# Altium schematic sheet HeadSensors.SchDoc
size A4 portrait; SheetNumber: 1; SheetTotal: 1
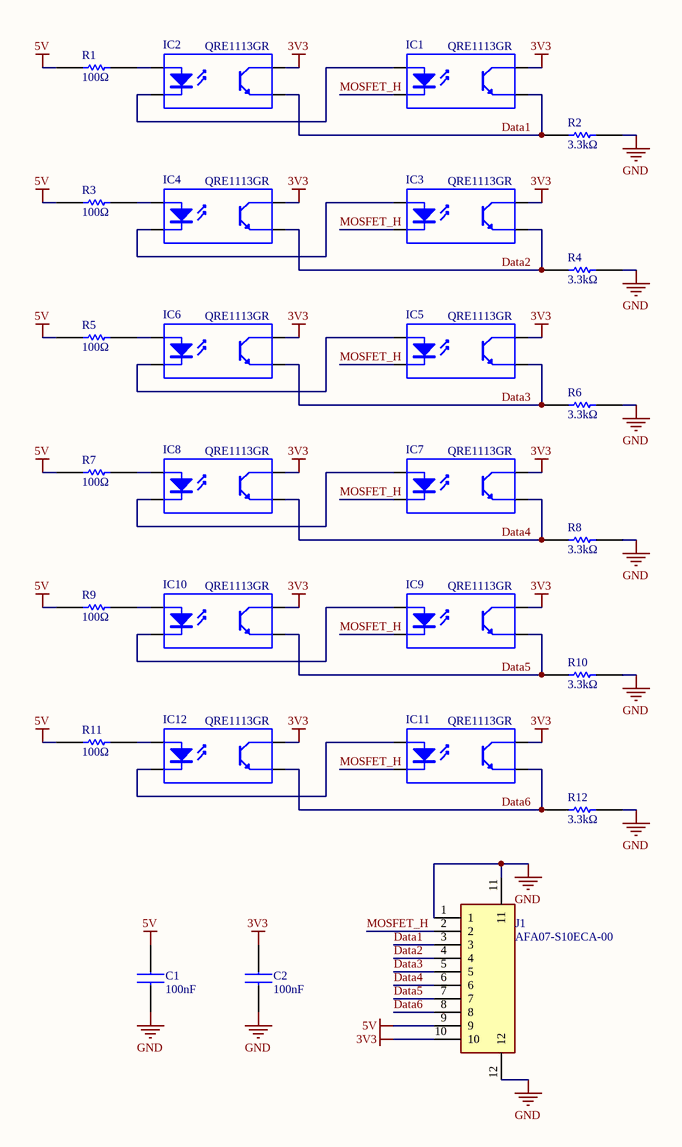
[diagram p0: HeadSensors.SchDoc]

## Parts
C1  value 100nF  [CAP0805]  (hidden comment: CC0805KRX7R9BB104)
C2  value 100nF  [CAP0805]  (hidden comment: CC0805KRX7R9BB104)
IC1  QRE1113GR  [SOIC4- Head]
IC2  QRE1113GR  [SOIC4- Head]
IC3  QRE1113GR  [SOIC4- Head]
IC4  QRE1113GR  [SOIC4- Head]
IC5  QRE1113GR  [SOIC4- Head]
IC6  QRE1113GR  [SOIC4- Head]
IC7  QRE1113GR  [SOIC4- Head]
IC8  QRE1113GR  [SOIC4- Head]
IC9  QRE1113GR  [SOIC4- Head]
IC10  QRE1113GR  [SOIC4- Head]
IC11  QRE1113GR  [SOIC4- Head]
IC12  QRE1113GR  [SOIC4- Head]
J1  AFA07-S10ECA-00  [FPC-SMD-P1.00-10P_LCS-SJ-H2.5]
R1  value 100Ω  [RES0805]  (hidden comment: 0805W8F1000T5E)
R2  value 3.3kΩ  [RES0805]  (hidden comment: 0805W8F3301T5E)
R3  value 100Ω  [RES0805]  (hidden comment: 0805W8F1000T5E)
R4  value 3.3kΩ  [RES0805]  (hidden comment: 0805W8F3301T5E)
R5  value 100Ω  [RES0805]  (hidden comment: 0805W8F1000T5E)
R6  value 3.3kΩ  [RES0805]  (hidden comment: 0805W8F3301T5E)
R7  value 100Ω  [RES0805]  (hidden comment: 0805W8F1000T5E)
R8  value 3.3kΩ  [RES0805]  (hidden comment: 0805W8F3301T5E)
R9  value 100Ω  [RES0805]  (hidden comment: 0805W8F1000T5E)
R10  value 3.3kΩ  [RES0805]  (hidden comment: 0805W8F3301T5E)
R11  value 100Ω  [RES0805]  (hidden comment: 0805W8F1000T5E)
R12  value 3.3kΩ  [RES0805]  (hidden comment: 0805W8F3301T5E)

## Nets
3V3: C2.1 IC1.3(C) IC2.3(C) IC3.3(C) IC4.3(C) IC5.3(C) IC6.3(C) IC7.3(C) IC8.3(C) IC9.3(C) IC10.3(C) IC11.3(C) IC12.3(C) J1.10
5V: C1.1 J1.9 R1.1 R3.1 R5.1 R7.1 R9.1 R11.1
GND: C1.2 C2.2 J1.1 J1.11 J1.12 R2.2 R4.2 R6.2 R8.2 R10.2 R12.2
Data1: IC1.4(E) IC2.4(E) J1.3 R2.1
Data2: IC3.4(E) IC4.4(E) J1.4 R4.1
Data3: IC5.4(E) IC6.4(E) J1.5 R6.1
Data4: IC7.4(E) IC8.4(E) J1.6 R8.1
Data5: IC9.4(E) IC10.4(E) J1.7 R10.1
Data6: IC11.4(E) IC12.4(E) J1.8 R12.1
MOSFET_H: IC1.2(K) IC3.2(K) IC5.2(K) IC7.2(K) IC9.2(K) IC11.2(K) J1.2
NetIC1_1: IC1.1(A) IC2.2(K)
NetIC2_1: IC2.1(A) R1.2
NetIC3_1: IC3.1(A) IC4.2(K)
NetIC4_1: IC4.1(A) R3.2
NetIC5_1: IC5.1(A) IC6.2(K)
NetIC6_1: IC6.1(A) R5.2
NetIC7_1: IC7.1(A) IC8.2(K)
NetIC8_1: IC8.1(A) R7.2
NetIC9_1: IC9.1(A) IC10.2(K)
NetIC10_1: IC10.1(A) R9.2
NetIC11_1: IC11.1(A) IC12.2(K)
NetIC12_1: IC12.1(A) R11.2

## Library data of the parts
C1 C2 = CC0805KRX7R9BB104: Multilayer Ceramic Capacitors MLCC - SMD/SMT 50 V 0.1uF X7R 0805 10%; Manufacturer_Name: YAGEO; Geometry.Height: 0.95mm; Manufacturer_Part_Number: CC0805KRX7R9BB104; Datasheet Link: https://www.yageo.com/upload/media/product/productsearch/datasheet/mlcc/UPY-GPHC_X7R_6.3V-to-50V_20.pdf; LCSC: C49678
IC1-IC12 = QRE1113GR_H: IC IR-SENSOR; Manufacturer: ON Semiconductor; Wavelength: 940nm; If - Forward Current Max: 50mA; Rise Time: 20us; Vf - Forward Voltage: 1.4V; Sensing Distance (máx): 5mm; Vce - Collector/Emitter Voltage Max: 30V; Ic - Collector Current Max: 20mA; Vr - Reverse Voltage: 5V; Pd - Power Dissipation:: 75mW; Library Control - Checked Footprint: Yes; Library Control - Last Project that Used: Follow-Final; Library Control - Person that Checked Footprint: Lucas; Library Control - Person that did the Last Update Footprint: Mateus(Dimas); Supplier 1: Mouser; Part Number: QRE1113GR; Category: Phototransistor; Price: 1=1,150, 10=0,955, 100=0,542 (USD); Package / Case: SMD-4 Gull Wing; Operating Temperature: -25°C ~ 85°C; Supplier Part Number 1: 512-QRE1113GR; If - Forward Curren t(test): 20mA; Library Ref: Phototransistor; Library Control - Checked Schematic: Yes; Library Control - Last Update: 24/04/2021 00:25; Library Control - Person that Checked Schematic: Lucas; Library Control - Person that did the Last Update Schematic: Mateus(Dimas); ComponentLink1Description: Datasheet; ComponentLink1URL: https://br.mouser.com/datasheet/2/308/QRE1113_D-1814544.pdf; ComponentLink2Description: Mouser Link; ComponentLink2URL: https://br.mouser.com/ProductDetail/ON-Semiconductor-Fairchild/QRE1113GR?qs=Qb0BA3xILekkPpSVC5x7uQ%3D%3D
J1 = AFA07-S10ECA-00: Drawer Type 10P Contact,Top Horizontal attachment 1mm SMD,P=1mm,Surface Mount，Right Angle FFC, FPC (Flat Flexible) Connector Assemblies ROHS; Manufacturer_Name: JUSHUO; Geometry.Height: 2.50mm; Manufacturer_Part_Number: AFA07-S10ECA-00; Datasheet Link: https://wmsc.lcsc.com/wmsc/upload/file/pdf/v2/lcsc/2304140030_JUSHUO-AFA07-S10ECA-00_C262737.pdf; LCSC: C262737
R1 R3 R5 R7 R9 R11 = 0805W8F1000T5E: 125mW Thick Film Resistors 150V ±100ppm/℃ ±1% 100Ω 0805 Chip Resistor - Surface Mount ROHS; Manufacturer_Name: UNI-ROYAL; Geometry.Height: 0.95mm; Manufacturer_Part_Number: 0805W8F1000T5E; Datasheet Link: https://wmsc.lcsc.com/wmsc/upload/file/pdf/v2/lcsc/2206010216_UNI-ROYAL-Uniroyal-Elec-0805W8F1000T5E_C17408.pdf; LCSC: C17408
R2 R4 R6 R8 R10 R12 = 0805W8F3301T5E: 125mW Thick Film Resistors 150V ±100ppm/℃ ±1% 3.3kΩ 0805 Chip Resistor - Surface Mount ROHS; Manufacturer_Name: UNI-ROYAL; Geometry.Height: 0.95mm; Manufacturer_Part_Number: 0805W8F3301T5E; Datasheet Link: https://wmsc.lcsc.com/wmsc/upload/file/pdf/v2/lcsc/2206010045_UNI-ROYAL-Uniroyal-Elec-0805W8F3301T5E_C26010.pdf; LCSC: C26010